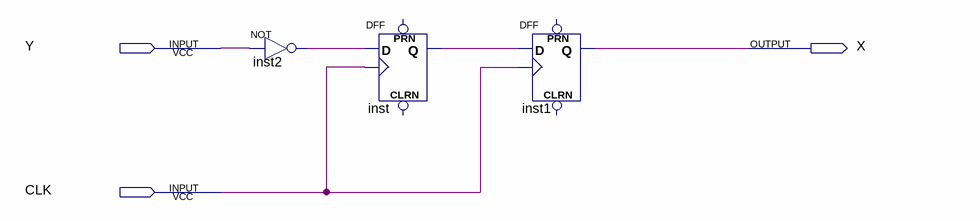
[diagram p0: schematic sheet]
// Quartus schematic SimpleStateMachine.bdf as structural Verilog: 3 symbols, 3 pins
module SimpleStateMachine (
  input  Y,
  input  CLK,
  output X
);

  wire inst2_out, inst_q;

  not inst2 (inst2_out, Y);
  DFF inst (.CLK(CLK), .D(inst2_out), .Q(inst_q));  // open: CLRN, PRN
  DFF inst1 (.CLK(CLK), .D(inst_q), .Q(X));  // open: CLRN, PRN
endmodule
